# Altium schematic sheet AD8495.SchDoc: Analog Temperature Sensor
size A4
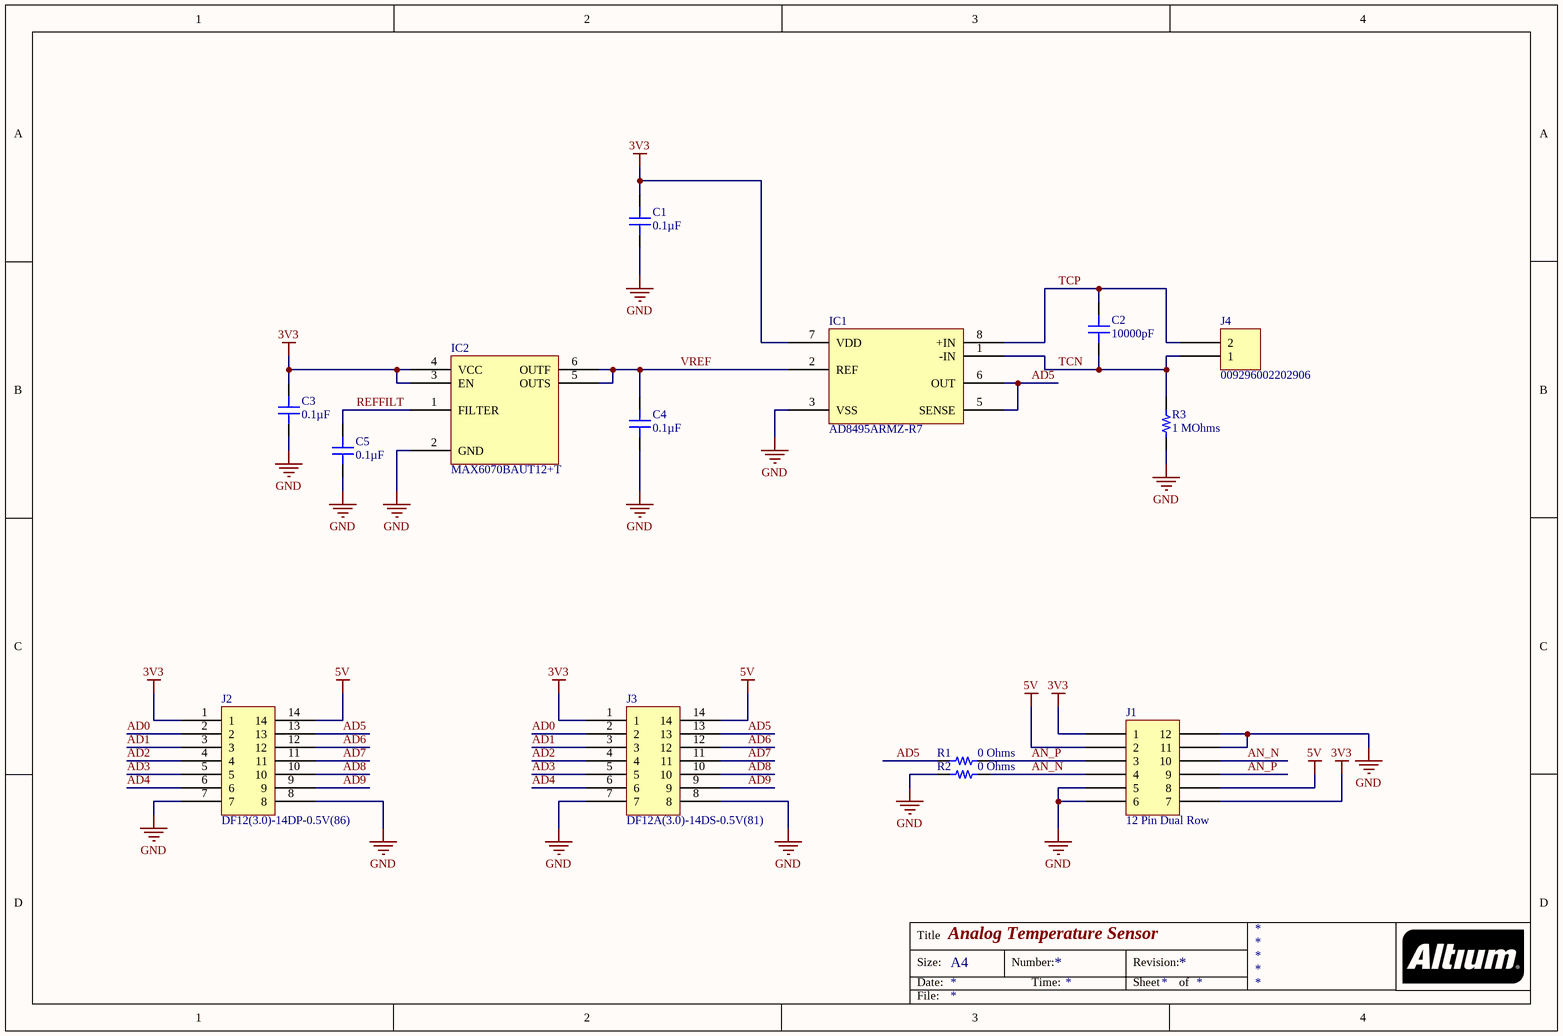
[diagram p0: AD8495.SchDoc]

## Parts
C1  0.1µF  [CAP 0603_1608]
C2  10000pF  [CAP 0603_1608]
C3  0.1µF  [CAP 0603_1608]
C4  0.1µF  [CAP 0603_1608]
C5  0.1µF  [CAP 0603_1608]
IC1  AD8495ARMZ-R7  [ANALOG MSOP-8 MS8 3X3MM]
IC2  MAX6070BAUT12+T  [MAXIM SOT-23-6]
J1  12 Pin Dual Row  [TE 5650118-3 Card Edge]
J2  DF12(3.0)-14DP-0.5V(86)  [HIROSE DF12 3.0-14DP-0.5V 86]
J3  DF12A(3.0)-14DS-0.5V(81)  [HIROSE DF12A 3.0-14DS-0.5V 81]
J4  009296002202906  [AVX 9296002202806]
R1  0 Ohms  [RES 0603_1608]
R2  0 Ohms  [RES 0603_1608]
R3  1 MOhms  [RES 0603_1608]

## Nets
3V3: C1.1 C3.1 IC1.7(VDD) IC2.3(EN) IC2.4(VCC) J1.1 J1.7 J2.1 J3.1
5V: J1.2 J1.8 J2.14 J3.14
GND: C1.2 C3.2 C4.2 C5.2 IC1.3(VSS) IC2.2(GND) J1.5 J1.6 J1.11 J1.12 J2.7 J2.8 J3.7 J3.8 R2.1 R3.1
AD0: J2.2 J3.2
AD1: J2.3 J3.3
AD2: J2.4 J3.4
AD3: J2.5 J3.5
AD4: J2.6 J3.6
AD5: IC1.5(SENSE) IC1.6(OUT) J2.13 J3.13 R1.1
AD6: J2.12 J3.12
AD7: J2.11 J3.11
AD8: J2.10 J3.10
AD9: J2.9 J3.9
AN_N: J1.4 J1.10 R2.2
AN_P: J1.3 J1.9 R1.2
REFFILT: C5.1 IC2.1(FILTER)
TCN: C2.1 IC1.1(-IN) J4.1 R3.2
TCP: C2.2 IC1.8(+IN) J4.2
VREF: C4.1 IC1.2(REF) IC2.5(OUTS) IC2.6(OUTF)

## Notes on the sheet
- Title
- Size:
- Date:
- A4
- Number:
- Time:
- Revision:
- Sheet
- of
- File:

## Library data of the parts
C1 C3-C5 = CC0603ZRY5V7BB104: CAP CER 0.1UF 16V Y5V 0603; Manufacturer: Yageo; Temperature Coefficient: Y5V (F); Tolerance: -20%, +80%; Part Number: CC0603ZRY5V7BB104; Value: 0.1µF; Applications: General Purpose; Capacitance: 0.1µF; ComponentLink1Description: Datasheet; ComponentLink1URL: http://www.yageo.com/documents/recent/UPY-GPHC_Y5V_6.3V-to-50V_8.pdf; ComponentLink2Description: DigiKey Link; ComponentLink2URL: http://digikey.com/product-detail/en/yageo/CC0603ZRY5V7BB104/311-1369-1-ND/2103153; Device Package: 0603 (1608 Metric); LastUpdated: 21/01/2020 00:01:38; Lifecycle Status: Active; Minimum Order: 1; Mounting Type: Surface Mount, MLCC; Operating Temperature: -30°C ~ 85°C; Package / Case: 0603 (1608 Metric); Packaging: TapeAndReel; PartId: 17881; Part Status: Active; Price: 0.01; Series: CC; Size / Dimension: 0.063" L x 0.031" W (1.60mm x 0.80mm); Supplier 1: DigiKey; Supplier Part Number 1: 311-1369-1-ND; Thickness (Max): 0.035" (0.90mm); Voltage - Rated: 16V
C2 = CGA3E2X7R2A103M080AA: CAP CER 10000PF 100V X7R 0603; Manufacturer: TDK Corporation; Tolerance: ±20%; Part Number: CGA3E2X7R2A103M080AA; Value: 10000pF; Applications: Automotive; Capacitance: 10000pF; ComponentLink1Description: Datasheet; ComponentLink1URL: https://product.tdk.com/info/en/catalog/datasheets/mlcc_automotive_midvoltage_en.pdf?ref_disty=digikey; ComponentLink2Description: DigiKey Link; ComponentLink2URL: http://digikey.com/product-detail/en/tdk-corporation/CGA3E2X7R2A103M080AA/445-12526-1-ND/3954192; Device Package: 0603 (1608 Metric); LastUpdated: 02/09/2020 01:03:33; Lifecycle Status: Active; Minimum Order: 1; Mounting Type: Surface Mount, MLCC; Operating Temperature: -55°C ~ 125°C; Package / Case: 0603 (1608 Metric); Packaging: TapeAndReel; PartId: 3633; Part Status: Active; Price: 0.01; Ratings: AEC-Q200; Series: CGA; Size / Dimension: 0.063" L x 0.031" W (1.60mm x 0.80mm); Supplier 1: DigiKey; Supplier Part Number 1: 445-12526-1-ND; Temperature Coefficient: X7R; Thickness (Max): 0.035" (0.90mm); Voltage - Rated: 100V
IC1 = AD8495ARMZ-R7: IC THERMOCOUPLE A W/COMP 8MSOP; Manufacturer: Analog Devices Inc.; Current - Supply: 250µA; Input Type: Differential; Output Type: Analog; Part Number: AD8495ARMZ-R7; ComponentLink1Description: Datasheet; ComponentLink1URL: https://www.analog.com/media/en/technical-documentation/data-sheets/AD8494_8495_8496_8497.pdf; ComponentLink2Description: DigiKey Link; ComponentLink2URL: http://digikey.com/product-detail/en/analog-devices-inc/AD8495ARMZ-R7/AD8495ARMZ-R7CT-ND/4909087; LastUpdated: 02/09/2020 01:30:37; Lifecycle Status: Active; Minimum Order: 1; Mounting Type: Surface Mount; Package / Case: 8-TSSOP, 8-MSOP (0.118", 3.00mm Width); Packaging: TapeAndReel; Part Status: Active; Price: 3.35; Series: -; Supplier 1: DigiKey; Supplier Part Number 1: AD8495ARMZ-R7CT-ND; Supplier Device Package: 8-MSOP; Type: Thermocouple Amplifier
IC2 = MAX6070BAUT12+T: IC VREF SERIES 0.08% SOT23-6; Manufacturer: Maxim Integrated; Current - Output: 10mA; Current - Supply: 260µA; Noise - 0.1Hz to 10Hz: 3.6µVp-p; Noise - 10Hz to 10kHz: 2.5µVrms; Output Type: Fixed; Temperature Coefficient: 8ppm/°C; Voltage - Input: 2.7V ~ 5.5V; Voltage - Output (Min/Fixed): 1.25V; Part Number: MAX6070BAUT12+T; ComponentLink1Description: Datasheet; ComponentLink1URL: https://datasheets.maximintegrated.com/en/ds/MAX6070-MAX6071.pdf; ComponentLink2Description: DigiKey Link; ComponentLink2URL: http://digikey.com/product-detail/en/maxim-integrated/MAX6070BAUT12-T/MAX6070BAUT12-TCT-ND/5051503; LastUpdated: 02/09/2020 01:24:53; Lifecycle Status: Active; Minimum Order: 1; Mounting Type: Surface Mount; Operating Temperature: -40°C ~ 125°C (TA); Package / Case: SOT-23-6; Packaging: TapeAndReel; Part Status: Active; Price: 1.01; Reference Type: Series; Series: -; Supplier 1: DigiKey; Supplier Part Number 1: MAX6070BAUT12+TCT-ND; Supplier Device Package: SOT-23-6; Tolerance: ±0.08%
J2 = DF12(3.0)-14DP-0.5V(86): CONN HDR 14POS SMD GOLD; Manufacturer: Hirose Electric Co Ltd; Connector Type: Header, Outer Shroud Contacts; Mated Stacking Heights: 3mm; Number of Positions: 14; Pitch: 0.020" (0.50mm); Part Number: DF12(3.0)-14DP-0.5V(86); ComponentLink1Description: Datasheet; ComponentLink1URL: https://www.hirose.com/product/download/?distributor=digikey&type=specSheet&lang=en&num=DF12(3.0)-14DP-0.5V(86); ComponentLink2Description: DigiKey Link; ComponentLink2URL: http://digikey.com/product-detail/en/hirose-electric-co-ltd/DF12-3.0-14DP-0.5V-86/H11701CT-ND/2172493; Contact Finish: Gold; Contact Finish Thickness: 8.00µin (0.203µm); Features: Board Guide, Solder Retention; Height Above Board: 0.091" (2.30mm); LastUpdated: 06/08/2020 22:47:47; Lifecycle Status: Active; Minimum Order: 1; Mounting Type: Surface Mount; Number of Rows: 2; Packaging: TapeAndReel; Part Status: Active; Price: 0.38; Series: DF12; Supplier 1: DigiKey; Supplier Part Number 1: H11701CT-ND
J3 = DF12A(3.0)-14DS-0.5V(81): CONN RCPT 14POS SMD GOLD; Manufacturer: Hirose Electric Co Ltd; Connector Type: Receptacle, Center Strip Contacts; Mated Stacking Heights: 3mm; Number of Positions: 14; Pitch: 0.020" (0.50mm); Part Number: DF12A(3.0)-14DS-0.5V(81); ComponentLink1Description: Datasheet; ComponentLink1URL: https://www.hirose.com/product/document?clcode=CL0537-0721-0-86&productname=DF12(3.0)-10DP-0.5V(86)&series=DF12&documenttype=Catalog&lang=en&documentid=D31693_en; ComponentLink2Description: DigiKey Link; ComponentLink2URL: http://digikey.com/product-detail/en/hirose-electric-co-ltd/DF12A-3.0-14DS-0.5V-81/H11713CT-ND/2172505; Contact Finish: Gold; Contact Finish Thickness: 8.00µin (0.203µm); Features: Board Guide; Height Above Board: 0.087" (2.20mm); LastUpdated: 06/08/2020 22:48:47; Lifecycle Status: Active; Minimum Order: 1; Mounting Type: Surface Mount; Number of Rows: 2; Packaging: TapeAndReel; Part Status: Active; Price: 0.36; Series: DF12; Supplier 1: DigiKey; Supplier Part Number 1: H11713CT-ND
J4 = 009296002202906: CONN WIRE POKE-IN 2POS SMD RA; Manufacturer: AVX Corporation; Board-Side Pitch: 0.118" (3.00mm); Connector Type: Individual Wires; Number of Positions: 2; Wire Gauge: 20-26 AWG; Part Number: 009296002202906; Cable Pitch: 0.118" (3.00mm); Cable Termination: Poke-In; Color: White; ComponentLink1Description: Datasheet; ComponentLink1URL: http://datasheets.avx.com/PHLPHorizontal_00-9296.pdf; ComponentLink2Description: DigiKey Link; ComponentLink2URL: http://digikey.com/product-detail/en/avx-corporation/009296002202906/478-9533-1-ND/5161727; Contact Finish: Tin; Features: Closed End; LastUpdated: 01/05/2020 07:29:21; Lifecycle Status: Active; Minimum Order: 1; Mounting Type: Surface Mount, Right Angle; Number of Rows: 1; Packaging: TapeAndReel; Part Status: Active; Price: 0.23; Series: 9296; Supplier 1: DigiKey; Supplier Part Number 1: 478-9533-1-ND
R1 R2 = ERJ-3GEY0R00V: RES SMD 0 OHM JUMPER 1/10W 0603; Manufacturer: Panasonic Electronic Components; Power (Watts): 0.1W, 1/10W; Part Number: ERJ-3GEY0R00V; Value: 0 Ohms; ComponentLink1Description: Datasheet; ComponentLink1URL: http://industrial.panasonic.com/www-cgi/jvcr13pz.cgi?E+PZ+3+AOA0001+ERJ3GEY0R00V+7+WW; ComponentLink2Description: DigiKey Link; ComponentLink2URL: http://digikey.com/product-detail/en/panasonic-electronic-components/ERJ-3GEY0R00V/P0.0GCT-ND/134711; Composition: Thick Film; Device Package: 0603 (1608 Metric); Features: Automotive AEC-Q200; Height - Seated (Max): 0.022" (0.55mm); LastUpdated: 13/08/2020 10:36:40; Lifecycle Status: Active; Minimum Order: 1; Number of Terminations: 2; Operating Temperature: -55°C ~ 155°C; Package / Case: 0603 (1608 Metric); Packaging: CutTape; PartId: 22603; Part Status: Active; Price: 0.10; Ratings: AEC-Q200; Resistance: 0 Ohms; Series: ERJ; Size / Dimension: 0.063" L x 0.031" W (1.60mm x 0.80mm); Supplier 1: DigiKey; Supplier Part Number 1: P0.0GCT-ND; Supplier Device Package: 0603; Tolerance: Jumper
R3 = CRGH0603J1M0: RES SMD 1M OHM 5% 1/5W 0603; Manufacturer: TE Connectivity Passive Product; Power (Watts): 0.2W, 1/5W; Temperature Coefficient: ±100ppm/°C; Part Number: CRGH0603J1M0; Value: 1 MOhms; ComponentLink1Description: Datasheet; ComponentLink1URL: https://www.te.com/commerce/DocumentDelivery/DDEController?Action=srchrtrv&DocNm=1773204-1&DocType=DS&DocLang=English; ComponentLink2Description: DigiKey Link; ComponentLink2URL: http://digikey.com/product-detail/en/te-connectivity-passive-product/CRGH0603J1M0/A126402CT-ND/7603457; Composition: Thick Film; Device Package: 0603 (1608 Metric); LastUpdated: 02/09/2020 01:10:08; Lifecycle Status: Active; Minimum Order: 1; Number of Terminations: 2; Operating Temperature: -55°C ~ 155°C; Package / Case: 0603 (1608 Metric); Packaging: TapeAndReel; PartId: 12962; Part Status: Active; Price: 0.01; Resistance: 1 MOhms; Series: CRGH, Neohm; Size / Dimension: 0.063" L x 0.031" W (1.60mm x 0.80mm); Supplier 1: DigiKey; Supplier Part Number 1: A126402CT-ND; Supplier Device Package: 0603; Tolerance: ±5%